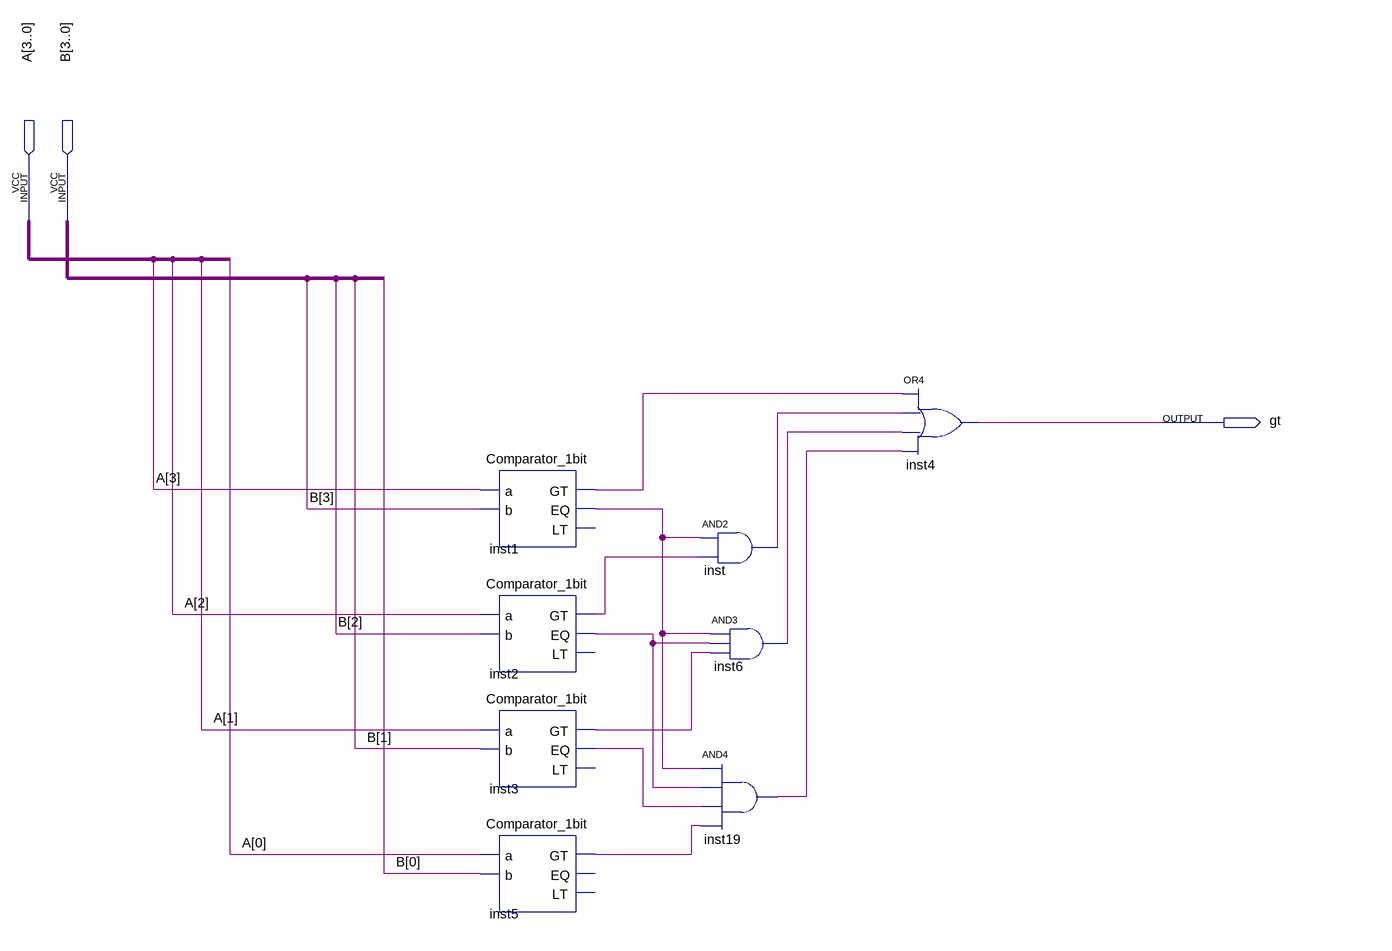
[diagram p0: schematic sheet]
// Quartus schematic GT.bdf as structural Verilog: 8 symbols, 3 pins
module GT (
  input  [3:0] A,
  input  [3:0] B,
  output gt
);

  wire inst1_eq, inst1_gt, inst2_eq, inst2_gt, inst3_eq, inst3_gt, inst5_gt, inst6_out, inst19_out, inst_out;

  Comparator_1bit inst1 (.a(A[3]), .b(B[3]), .GT(inst1_gt), .EQ(inst1_eq));  // open: LT
  Comparator_1bit inst2 (.a(A[2]), .b(B[2]), .GT(inst2_gt), .EQ(inst2_eq));  // open: LT
  Comparator_1bit inst3 (.a(A[1]), .b(B[1]), .GT(inst3_gt), .EQ(inst3_eq));  // open: LT
  Comparator_1bit inst5 (.a(A[0]), .b(B[0]), .GT(inst5_gt));  // open: EQ, LT
  and inst (inst_out, inst1_eq, inst2_gt);
  and inst6 (inst6_out, inst1_eq, inst2_eq, inst3_gt);
  and inst19 (inst19_out, inst1_eq, inst2_eq, inst3_eq, inst5_gt);
  or inst4 (gt, inst1_gt, inst_out, inst6_out, inst19_out);
endmodule
